# Altium project steve.PrjPcb (part 3 of 3)

## Sheet ltc1474_400mA.SchDoc
size A4
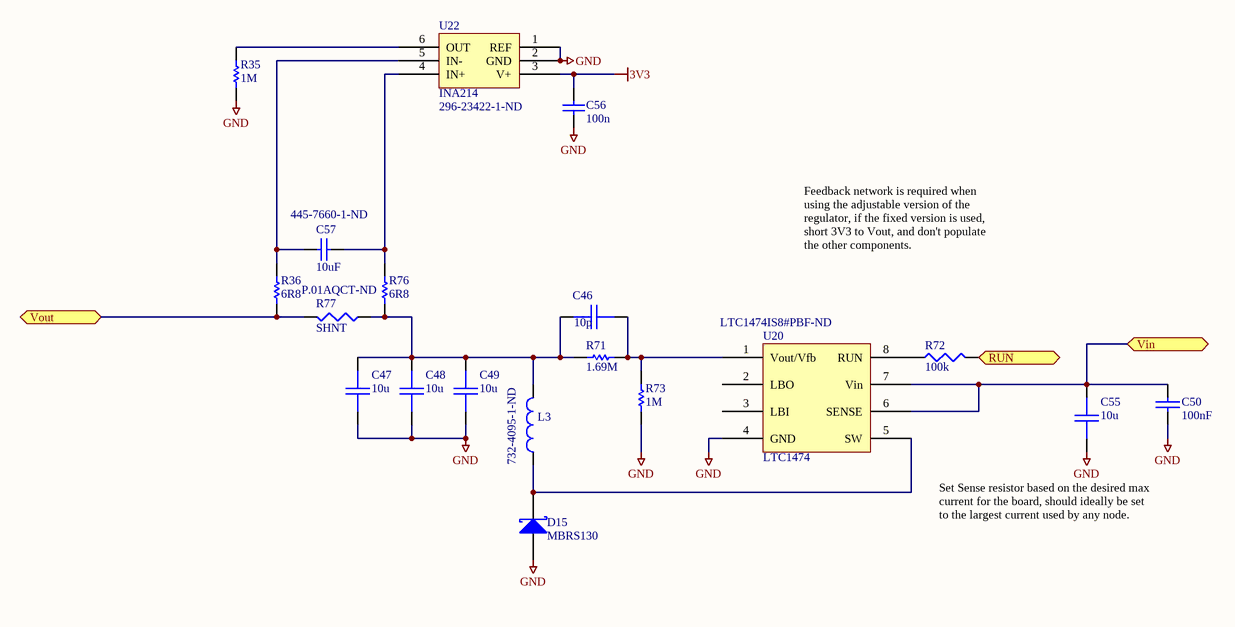
[diagram p11: ltc1474_400mA.SchDoc]

### Parts
C46  10p  [0603]
C47  10u  [1206]
C48  10u  [1206]
C49  10u  [1206]
C50  100nF  [0603]
C55  10u  [1206]
C56  100n  [0603]
C57  10uF  Supplier Part Number 1: 445-7660-1-ND  [0805]
D15  MBRS130  [SMB]
L3  Supplier Part Number 1: 732-4095-1-ND  [WE-TPC-744065221]  (hidden comment: INDUCTOR)
R35  1M  [0603]
R36  6R8  [0603]
R71  1.69M  [0603]
R72  100k  [0603]
R73  1M  [0603]
R76  6R8  [0603]
R77  SHNT  Supplier Part Number 1: P.01AQCT-ND  [0805]
U20  LTC1474  Supplier Part Number 1: LTC1474IS8#PBF-ND  [SO8]
U22  INA214  Supplier Part Number 1: 296-23422-1-ND  [SC70-6]

### Ports
RUN, Vin, Vout

### Nets
3V3: C56.2 U22.3(V+)
GND: C47.2 C48.2 C49.2 C50.2 C55.2 C56.1 D15.A R35.1 R73.1 U20.4(GND) U22.1(REF) U22.2(GND)
Vin: C50.1 C55.1 U20.6(SENSE) U20.7(Vin) ; port Vin
VLED: R36.2 R77.2 ; port Vout
VLED_EN: R72.2 ; port RUN
NetC46_1: C46.1 C47.1 C48.1 C49.1 L3.2 R71.1 R76.2 R77.1
NetC46_2: C46.2 R71.2 R73.2 U20.1(Vout/Vfb)
NetC57_1: C57.1 R36.1 U22.5(IN-)
NetC57_2: C57.2 R76.1 U22.4(IN+)
NetD15_K: D15.K L3.1 U20.5(SW)
NetR35_2: R35.2 U22.6(OUT)
NetR72_1: R72.1 U20.8(RUN)

Not connected (* = marked no-connect by the designer): U20 2(LBO) 3(LBI)

### Notes on the sheet
- Feedback network is required when using the adjustable version of the regulator, if the fixed version is used, short 3V3 to Vout, and don't populate the other components.
- (near C55) Set Sense resistor based on the desired max current for the board, should ideally be set to the largest current used by any node.

### Library data of the parts
C46 = CAP: Capacitor; Manufacturer: TDK Corporation; Manufacturer Part Number: C1608C0G1H100D080AA; Value: 1nF; Description: CAP CER 10PF 50V NP0 0603; Capacitance: 10pF; Voltage - Rated: 50V; Tolerance: ±0.5pF; Temperature Coefficient: C0G, NP0; Revision: July-2002: Re-released for DXP Platform.; Farnell: 317-202; Price: 0.15; Supplier 1: Digi-Key; Supplier Part Number 1: 445-1269-1-ND; RoHS: RoHS Compliant; Category: Capacitors; Stock 1: 206915; Pricing 1: 1=0.12, 10=0.043, 100=0.0198, 250=0.01624, 500=0.0139, 1000=0.01082 (AUD); Packaging: Cut Tape (CT); Mounting Type: Surface Mount, MLCC; Operating Temperature: -55°C ~ 125°C; Applications: General Purpose; Ratings: -; Package / Case: 0603 (1608 Metric); Size / Dimension: 0.063" L x 0.031" W (1.60mm x 0.80mm); Height - Seated (Max): -; Thickness (Max): 0.037" (0.95mm); Lead Spacing: -; Features: -; Lead Style: -; ComponentLink1URL: http://product.tdk.com/capacitor/mlcc/en/documents/mlcc_commercial_general_en.pdf; ComponentLink1Description: http://product.tdk.com/capacitor/mlcc/en/documents/mlcc_commercial_general_en.pdf
C47-C49 C55 = CAP: Capacitor; Manufacturer: TDK Corporation; Manufacturer Part Number: C3216X5R1A106M160AB; Description: CAP CER 10UF 10V 20% X5R 1206; Capacitance: 10µF; Voltage - Rated: 10V; Tolerance: ±20%; Temperature Coefficient: X5R; Supplier 1: Digi-Key; Supplier Part Number 1: 445-1387-1-ND; RoHS: RoHS Compliant; Category: Capacitors; Stock 1: 132841; Pricing 1: 1=0.32, 10=0.274, 100=0.137, 250=0.10276, 500=0.09076, 1000=0.0805 (AUD); Packaging: Cut Tape (CT); Mounting Type: Surface Mount, MLCC; Operating Temperature: -55°C ~ 85°C; Applications: General Purpose; Ratings: -; Package / Case: 1206 (3216 Metric); Size / Dimension: 0.126" L x 0.063" W (3.20mm x 1.60mm); Height - Seated (Max): -; Thickness (Max): 0.071" (1.80mm); Lead Spacing: -; Features: -; Lead Style: -; ComponentLink1URL: http://product.tdk.com/capacitor/mlcc/en/documents/mlcc_commercial_general_en.pdf; ComponentLink1Description: http://product.tdk.com/capacitor/mlcc/en/documents/mlcc_commercial_general_en.pdf
C50 = CAP: Capacitor; Manufacturer: TDK Corporation; Manufacturer Part Number: C1608X7R1H103K080AA; Needed?: NO - HW LAB; Description: CAP CER 10000PF 50V 10% X7R 0603; Capacitance: 10000pF; Voltage - Rated: 50V; Tolerance: ±10%; Temperature Coefficient: X7R; Value: 100nF; Supplier 1: Digi-Key; Supplier Part Number 1: 445-1311-1-ND; RoHS: RoHS Compliant; Category: Capacitors; Stock 1: 569984; Pricing 1: 1=0.14, 10=0.035, 100=0.0159, 250=0.01296, 500=0.0111, 1000=0.00865 (AUD); Packaging: Cut Tape (CT); Mounting Type: Surface Mount, MLCC; Operating Temperature: -55°C ~ 125°C; Applications: General Purpose; Ratings: -; Package / Case: 0603 (1608 Metric); Size / Dimension: 0.063" L x 0.031" W (1.60mm x 0.80mm); Height - Seated (Max): -; Thickness (Max): 0.037" (0.95mm); Lead Spacing: -; Features: -; Lead Style: -; ComponentLink1URL: http://product.tdk.com/capacitor/mlcc/en/documents/mlcc_commercial_general_en.pdf; ComponentLink1Description: http://product.tdk.com/capacitor/mlcc/en/documents/mlcc_commercial_general_en.pdf
C56 = Cap Semi: Capacitor (Semiconductor SIM Model); Value: 100nF; Published: 8-Jun-2000; LatestRevisionDate: 17-Jul-2002; LatestRevisionNote: Re-released for DXP Platform.; PackageReference: C1206; Publisher: Altium Limited; Element14: 9406140; Element14 Price: 0.13
C57 = Cap Semi: Capacitor (Semiconductor SIM Model); Manufacturer: TDK Corporation; Manufacturer Part Number: C2012X5R1A106K125AB; Description: CAP CER 10UF 10V 10% X5R 0805; Capacitance: 10µF; Voltage - Rated: 10V; Tolerance: ±10%; Temperature Coefficient: X5R; Value: 10uF; Element14: 1458902RL; Element14 Price: 0.69; Supplier 1: Digi-Key; RoHS: RoHS Compliant; Category: Capacitors; Stock 1: 260840; Pricing 1: 1=0.24, 10=0.163, 100=0.0833, 250=0.06744, 500=0.05948, 1000=0.05057 (AUD); Packaging: Cut Tape (CT); Mounting Type: Surface Mount, MLCC; Operating Temperature: -55°C ~ 85°C; Applications: General Purpose; Ratings: -; Package / Case: 0805 (2012 Metric); Size / Dimension: 0.079" L x 0.049" W (2.00mm x 1.25mm); Height - Seated (Max): -; Thickness (Max): 0.057" (1.45mm); Lead Spacing: -; Features: -; Lead Style: -; ComponentLink1URL: http://product.tdk.com/capacitor/mlcc/en/documents/mlcc_commercial_general_en.pdf; ComponentLink1Description: http://product.tdk.com/capacitor/mlcc/en/documents/mlcc_commercial_general_en.pdf
D15 = D SCHOTTKY: Schottky Diode; Manufacturer: Fairchild Semiconductor; Manufacturer Part Number: MBRS130L; Description: DIODE SCHOTTKY 30V 2A DO214AA; Voltage - DC Reverse (Vr) (Max): 30V; Current - Average Rectified (Io): 2A; Voltage - Forward (Vf) (Max) @ If: 445mV @ 2A; Speed: Fast Recovery =< 500ns, > 200mA (Io); Current - Reverse Leakage @ Vr: 1mA @ 30V; Revision: July-2002: Re-released for DXP Platform.; Farnell: 708-150; Price: 1.49; Supplier 1: Digi-Key; Supplier Part Number 1: MBRS130LFSCT-ND; RoHS: RoHS Compliant; Category: Discrete Semiconductor Products; Stock 1: 14124; Pricing 1: 1=0.54, 10=0.428, 25=0.3612, 100=0.2942, 250=0.24364, 500=0.20126, 1000=0.15074 (AUD); Packaging: Cut Tape (CT); Diode Type: Schottky; Reverse Recovery Time (trr): -; Capacitance @ Vr, F: -; Mounting Type: Surface Mount; Package / Case: DO-214AA, SMB; Supplier Device Package: DO-214AA (SMB); ComponentLink1URL: http://www.fairchildsemi.com/ds/MB/MBRS130L.pdf; ComponentLink1Description: http://www.fairchildsemi.com/ds/MB/MBRS130L.pdf
L3 = INDUCTOR: Manufacturer: Wurth Electronics Inc; Manufacturer Part Number: 744065221; Description: INDUCTOR POWER 220UH .50A SMD; Type: Ferrite Core; Inductance: 220µH; Current Rating: 500mA; Current - Saturation: 550mA; Tolerance: ±30%; Material - Core: Ferrite; Shielding: Shielded; DC Resistance (DCR): 1 Ohm Max; Frequency - Test: 100kHz; Supplier 1: Digi-Key; RoHS: RoHS Compliant; Category: Inductors, Coils, Chokes; Stock 1: 1996; Pricing 1: 1=4.4, 10=4.081, 25=3.768, 50=3.2652, 100=2.8885, 250=2.76292, 500=2.63734 (AUD); Packaging: Cut Tape (CT); Q @ Freq: -; Frequency - Self Resonant: -; Operating Temperature: -40°C ~ 125°C; Package / Case: Non Standard; Size / Dimension: 0.394" L x 0.394" W x 0.110" H (10.00mm x 10.00mm x 2.80mm); Mounting Type: Surface Mount; ComponentLink1URL: http://katalog.we-online.de/pbs/datasheet/744065221.pdf; ComponentLink1Description: http://katalog.we-online.de/pbs/datasheet/744065221.pdf
R35 R73 = Res Semi: Semiconductor Resistor; Manufacturer: Panasonic Electronic Components; Manufacturer Part Number: ERJ-3EKF1004V; Value: R0; Description: RES 1M OHM 1/10W 1% 0603 SMD; Power (Watts): 0.1W, 1/10W; Temperature Coefficient: ±100ppm/°C; Tolerance: ±1%; Published: 8-Jun-2000; LatestRevisionDate: 17-Jul-2002; LatestRevisionNote: Re-released for DXP Platform.; PackageReference: AXIAL-0.5; Publisher: Altium Limited; PackageDescription: Axial Device, Thru-Hole; 2 Leads; 0.5 in Pin Spacing; Supplier 1: Digi-Key; Supplier Part Number 1: P1.00MHCT-ND; RoHS: RoHS Compliant; Category: Resistors; Stock 1: 1075295; Pricing 1: 1=0.12, 50=0.0166, 100=0.0126, 250=0.00936, 500=0.00692, 1000=0.00461 (AUD); Packaging: Cut Tape (CT); Resistance (Ohms): 1M; Composition: Thick Film; Features: -; Package / Case: 0603 (1608 Metric); Supplier Device Package: 0603; Size / Dimension: 0.063" L x 0.031" W (1.60mm x 0.80mm); Height: 0.022" (0.55mm); Number of Terminations: 2; ComponentLink1URL: http://industrial.panasonic.com/www-cgi/jvcr13pz.cgi?E+PZ+3+AOA0002+ERJ3EKF1004V+7+WW; ComponentLink1Description: http://industrial.panasonic.com/www-cgi/jvcr13pz.cgi?E+PZ+3+AOA0002+ERJ3EKF1004V+7+WW
R36 R76 = Res Semi: Semiconductor Resistor; Manufacturer: Panasonic Electronic Components; Manufacturer Part Number: ERJ-3GEYJ6R8V; Description: RES 6.8 OHM 1/10W 5% 0603 SMD; Resistance (Ohms): 6.8; Power (Watts): 0.1W, 1/10W; Temperature Coefficient: -100/ +600ppm/°C; Tolerance: ±5%; Published: 8-Jun-2000; LatestRevisionDate: 17-Jul-2002; LatestRevisionNote: Re-released for DXP Platform.; PackageReference: AXIAL-0.5; Publisher: Altium Limited; Value: 6R8; Element14: 9331492RL; Element14 Price: 0.08 (min order 50); Supplier 1: Digi-Key; Supplier Part Number 1: P6.8GCT-ND; RoHS: RoHS Compliant; Category: Resistors; Stock 1: 133530; Pricing 1: 1=0.12, 50=0.011, 100=0.0084, 250=0.00624, 500=0.00462, 1000=0.00308 (AUD); Packaging: Cut Tape (CT); Composition: Thick Film; Features: -; Package / Case: 0603 (1608 Metric); Supplier Device Package: 0603; Size / Dimension: 0.063" L x 0.031" W (1.60mm x 0.80mm); Height: 0.022" (0.55mm); Number of Terminations: 2; ComponentLink1URL: http://industrial.panasonic.com/www-cgi/jvcr13pz.cgi?E+PZ+3+AOA0001+ERJ3GEYJ6R8V+7+WW; ComponentLink1Description: http://industrial.panasonic.com/www-cgi/jvcr13pz.cgi?E+PZ+3+AOA0001+ERJ3GEYJ6R8V+7+WW
R71 = Res Semi: Semiconductor Resistor; Manufacturer: Samsung Electro-Mechanics America, Inc; Manufacturer Part Number: RC1608F1694CS; Value: R0; Description: RES 1.69M OHM 1/10W 1% 0603; Power (Watts): 0.1W, 1/10W; Temperature Coefficient: ±300ppm/°C; Tolerance: ±1%; Published: 8-Jun-2000; LatestRevisionDate: 17-Jul-2002; LatestRevisionNote: Re-released for DXP Platform.; PackageReference: AXIAL-0.5; Publisher: Altium Limited; PackageDescription: Axial Device, Thru-Hole; 2 Leads; 0.5 in Pin Spacing; Supplier 1: Digi-Key; Supplier Part Number 1: 1276-4940-1-ND; RoHS: RoHS Compliant; Category: Resistors; Stock 1: 9990; Pricing 1: 1=0.12, 10=0.023, 25=0.0168, 50=0.0128, 100=0.0094, 250=0.00716, 500=0.00572, 1000=0.00421, 2500=0.00365 (AUD); Packaging: Cut Tape (CT); Resistance (Ohms): 1.69M; Composition: Thick Film; Features: -; Package / Case: 0603 (1608 Metric); Supplier Device Package: 0603 (1608 Metric); Size / Dimension: 0.063" L x 0.031" W (1.60mm x 0.80mm); Height: 0.022" (0.55mm); Number of Terminations: 2; ComponentLink1URL: http://www.samsungsem.com/servlet/FileDownload?filename=productcatalog/pdf/Chip_Resistor.pdf; ComponentLink1Description: http://www.samsungsem.com/servlet/FileDownload?filename=productcatalog/pdf/Chip_Resistor.pdf
R72 = RES1: Resistor; Manufacturer: Panasonic Electronic Components; Manufacturer Part Number: ERJ-3EKF1003V; Description: RES 100K OHM 1/10W 1% 0603 SMD; Power (Watts): 0.1W, 1/10W; Temperature Coefficient: ±100ppm/°C; Tolerance: ±1%; Supplier 1: Digi-Key; Supplier Part Number 1: P100KHCT-ND; RoHS: RoHS Compliant; Category: Resistors; Stock 1: 8186012; Pricing 1: 1=0.12, 50=0.0166, 100=0.0126, 250=0.00936, 500=0.00692, 1000=0.00461 (AUD); Packaging: Cut Tape (CT); Resistance (Ohms): 100k; Composition: Thick Film; Features: -; Package / Case: 0603 (1608 Metric); Supplier Device Package: 0603; Size / Dimension: 0.063" L x 0.031" W (1.60mm x 0.80mm); Height: 0.022" (0.55mm); Number of Terminations: 2; ComponentLink1URL: http://industrial.panasonic.com/www-cgi/jvcr13pz.cgi?E+PZ+3+AOA0002+ERJ3EKF1003V+7+WW; ComponentLink1Description: http://industrial.panasonic.com/www-cgi/jvcr13pz.cgi?E+PZ+3+AOA0002+ERJ3EKF1003V+7+WW
R77 = Res3: Resistor; Manufacturer: Panasonic Electronic Components; Manufacturer Part Number: ERJ-6BWFR010V; Description: RES 0.01 OHM 1/2W 1% 0805 SMD; Resistance (Ohms): 0.01; Power (Watts): 0.5W, 1/2W; Temperature Coefficient: ±300ppm/°C; Tolerance: ±1%; Publisher: Altium Limited; Element14: 8067520; Element14 Price: 0.62; Supplier 1: Digi-Key; RoHS: RoHS Compliant; Category: Resistors; Stock 1: 6983; Pricing 1: 1=1.38, 50=0.7394, 100=0.6469, 250=0.573, 500=0.48058, 1000=0.36967 (AUD); Packaging: Cut Tape (CT); Composition: Thick Film; Features: -; Package / Case: 0805 (2012 Metric); Supplier Device Package: 0805; Size / Dimension: 0.079" L x 0.049" W (2.00mm x 1.25mm); Height: 0.030" (0.75mm); Number of Terminations: 2; ComponentLink1URL: http://industrial.panasonic.com/www-data/pdf/AOA0000/AOA0000CE3.pdf; ComponentLink1Description: http://industrial.panasonic.com/www-data/pdf/AOA0000/AOA0000CE3.pdf
U20 = LTC1474: Step-down converter; Manufacturer: Linear Technology; Manufacturer Part Number: LTC1474IS8#PBF; Description: IC REG BUCK ADJ 0.75A 8SOIC; Output Type: Adjustable; Number of Outputs: 1; Voltage - Input: 3 V ~ 18 V; PWM Type: Burst Mode®; Current - Output: 750mA; Synchronous Rectifier: No; Farnell: NA; Supplier 1: Digi-Key; RoHS: RoHS Compliant; Category: Integrated Circuits (ICs); Stock 1: 587; Pricing 1: 1=9.96, 25=6.616, 100=5.2879 (AUD); Packaging: Tube; Type: Step-Down (Buck); Voltage - Output: Adjustable; Frequency - Switching: -; Operating Temperature: -40°C ~ 85°C; Mounting Type: Surface Mount; Package / Case: 8-SOIC (0.154", 3.90mm Width); Supplier Device Package: 8-SOIC; ComponentLink1URL: http://www.linear.com/docs/1377; ComponentLink1Description: http://www.linear.com/docs/1377
U22 = INA214: Current Shunt Monitor; Manufacturer: Texas Instruments; Manufacturer Part Number: INA214AIDCKT; Description: IC CURRENT MONITOR 1% SC70-6; Function: Current Monitor; Sensing Method: High/Low-Side; Accuracy: ±1%; Voltage - Input: 2.7 V ~ 26 V; Element14: 1754262; Element14 Price: $4.22; Supplier 1: Digi-Key; RoHS: RoHS Compliant; Category: Integrated Circuits (ICs); Stock 1: 2023; Pricing 1: 1=2.58, 10=2.336, 25=2.0932, 100=1.0952 (AUD); Packaging: Cut Tape (CT); Current - Output: -; Operating Temperature: -40°C ~ 125°C; Mounting Type: Surface Mount; Package / Case: 6-TSSOP, SC-88, SOT-363; Supplier Device Package: SC-70-6; ComponentLink1URL: http://www.ti.com/lit/ds/symlink/ina210.pdf; ComponentLink1Description: http://www.ti.com/lit/ds/symlink/ina210.pdf

## Sheet status_leds.SchDoc
size A4
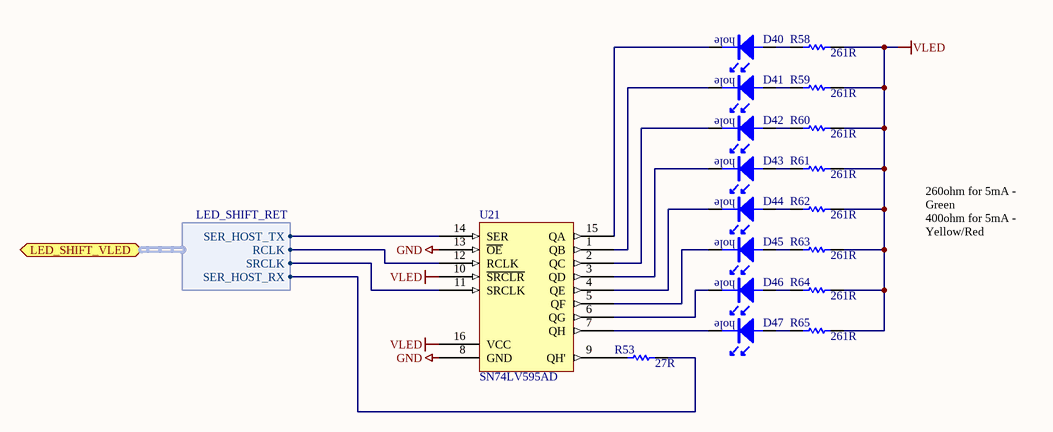
[diagram p12: status_leds.SchDoc]

### Parts
D40  (no value)  [LED0.1]
D41  (no value)  [LED0.1]
D42  (no value)  [LED0.1]
D43  (no value)  [LED0.1]
D44  (no value)  [LED0.1]
D45  (no value)  [LED0.1]
D46  (no value)  [LED0.1]
D47  (no value)  [LED0.1]
R53  27R  [0603]
R58  261R  [0603]
R59  261R  [0603]
R60  261R  [0603]
R61  261R  [0603]
R62  261R  [0603]
R63  261R  [0603]
R64  261R  [0603]
R65  261R  [0603]
U21  SN74LV595AD  [SOIC127P600X175-16N]

### Ports
LED_SHIFT_VLED (harness LED_SHIFT_RET)

### Harnesses
LED_SHIFT_RET: RCLK, SER_HOST_RX, SER_HOST_TX, SRCLK

### Nets
GND: U21.8(GND) U21.13(~{OE})
VLED: R58.1 R59.1 R60.1 R61.1 R62.1 R63.1 R64.1 R65.1 U21.10(~{SRCLR}) U21.16(VCC)
NetD40_A: D40.A R58.2
NetD40_K: D40.K U21.15(QA)
NetD41_A: D41.A R59.2
NetD41_K: D41.K U21.1(QB)
NetD42_A: D42.A R60.2
NetD42_K: D42.K U21.2(QC)
NetD43_A: D43.A R61.2
NetD43_K: D43.K U21.3(QD)
NetD44_A: D44.A R62.2
NetD44_K: D44.K U21.4(QE)
NetD45_A: D45.A R63.2
NetD45_K: D45.K U21.5(QF)
NetD46_A: D46.A R64.2
NetD46_K: D46.K U21.6(QG)
NetD47_A: D47.A R65.2
NetD47_K: D47.K U21.7(QH)
NetR11_1: U21.12(RCLK) ; port LED_SHIFT_VLED.RCLK
NetR12_1: U21.11(SRCLK) ; port LED_SHIFT_VLED.SRCLK
NetR52_1: U21.14(SER) ; port LED_SHIFT_VLED.SER_HOST_TX
NetR53_1: R53.1 ; port LED_SHIFT_VLED.SER_HOST_RX
NetR53_2: R53.2 U21.9(QH')

### Notes on the sheet
- 260ohm for 5mA - Green
  400ohm for 5mA - Yellow/Red
- (in symbol LED_HOLE) hole

### Library data of the parts
D40-D47 = LED_HOLE: through hole LED; Manufacturer: TT Electronics/Optek Technology; Manufacturer Part Number: OVLBG4C7; Description: LED 525NM ROUND GREEN 3MM; Color: Green; Millicandela Rating: 2000mcd; Voltage - Forward (Vf) Typ: 3.4V; Current - Test: 20mA; Wavelength - Dominant: 525nm; Wavelength - Peak: 521nm; Viewing Angle: 45°; Lens Type: Clear; Lens Style/Size: Round with Domed Top, 3mm, T-1; Supplier 1: Digi-Key; Supplier Part Number 1: 365-1174-ND; RoHS: RoHS Compliant; Category: Optoelectronics; Stock 1: 22554; Pricing 1: 1=0.61, 100=0.5516, 250=0.53544, 500=0.51918, 1000=0.48673, 2500=0.4705, 5000=0.45428, 25000=0.43805 (AUD); Packaging: Bulk; Package / Case: Radial; Size / Dimension: -; Height: 5.10mm; Mounting Type: Through Hole; Luminous Flux @ Current - Test: -; ComponentLink1URL: http://media.digikey.com/pdf/Data%20Sheets/Optek%20PDFs/OVLBG4C7.pdf; ComponentLink1Description: http://media.digikey.com/pdf/Data%20Sheets/Optek%20PDFs/OVLBG4C7.pdf
R53 = Res Semi: Semiconductor Resistor; Manufacturer: Panasonic Electronic Components; Manufacturer Part Number: ERJ-3EKF27R0V; Value: 1K; Description: RES 27 OHM 1/10W 1% 0603 SMD; Resistance (Ohms): 27; Power (Watts): 0.1W, 1/10W; Temperature Coefficient: ±100ppm/°C; Tolerance: ±1%; Published: 8-Jun-2000; LatestRevisionDate: 17-Jul-2002; LatestRevisionNote: Re-released for DXP Platform.; PackageReference: AXIAL-0.5; Publisher: Altium Limited; PackageDescription: Axial Device, Thru-Hole; 2 Leads; 0.5 in Pin Spacing; Supplier 1: Digi-Key; Supplier Part Number 1: P27.0HCT-ND; RoHS: RoHS Compliant; Category: Resistors; Stock 1: 89523; Pricing 1: 1=0.12, 50=0.0166, 100=0.0126, 250=0.00936, 500=0.00692, 1000=0.00461 (AUD); Packaging: Cut Tape (CT); Composition: Thick Film; Features: -; Package / Case: 0603 (1608 Metric); Supplier Device Package: 0603; Size / Dimension: 0.063" L x 0.031" W (1.60mm x 0.80mm); Height: 0.022" (0.55mm); Number of Terminations: 2; ComponentLink1URL: http://industrial.panasonic.com/www-cgi/jvcr13pz.cgi?E+PZ+3+AOA0002+ERJ3EKF27R0V+7+WW; ComponentLink1Description: http://industrial.panasonic.com/www-cgi/jvcr13pz.cgi?E+PZ+3+AOA0002+ERJ3EKF27R0V+7+WW
R58-R65 = Res Semi: Semiconductor Resistor; Manufacturer: Panasonic Electronic Components; Manufacturer Part Number: ERJ-3EKF2610V; Value: 1K; Description: RES 261 OHM 1/10W 1% 0603 SMD; Resistance (Ohms): 261; Power (Watts): 0.1W, 1/10W; Temperature Coefficient: ±100ppm/°C; Tolerance: ±1%; Published: 8-Jun-2000; LatestRevisionDate: 17-Jul-2002; LatestRevisionNote: Re-released for DXP Platform.; PackageReference: AXIAL-0.5; Publisher: Altium Limited; PackageDescription: Axial Device, Thru-Hole; 2 Leads; 0.5 in Pin Spacing; Supplier 1: Digi-Key; Supplier Part Number 1: P261HCT-ND; RoHS: RoHS Compliant; Category: Resistors; Stock 1: 84589; Pricing 1: 1=0.12, 50=0.0166, 100=0.0126, 250=0.00936, 500=0.00692, 1000=0.00461 (AUD); Packaging: Cut Tape (CT); Composition: Thick Film; Features: -; Package / Case: 0603 (1608 Metric); Supplier Device Package: 0603; Size / Dimension: 0.063" L x 0.031" W (1.60mm x 0.80mm); Height: 0.022" (0.55mm); Number of Terminations: 2; ComponentLink1URL: http://industrial.panasonic.com/www-cgi/jvcr13pz.cgi?E+PZ+3+AOA0002+ERJ3EKF2610V+7+WW; ComponentLink1Description: http://industrial.panasonic.com/www-cgi/jvcr13pz.cgi?E+PZ+3+AOA0002+ERJ3EKF2610V+7+WW
U21 = SN74LV595AD: 8-Bit Shift Registers with 3-State Output Registers; Manufacturer: Texas Instruments; Manufacturer Part Number: SN74LV595ADR; Description: IC 8-BIT SHFT REG TRI-ST 16-SOIC; Output Type: Tri-State; Number of Elements: 1; Number of Bits per Element: 8; Function: Serial to Parallel, Serial; Voltage - Supply: 2 V ~ 5.5 V; Supplier 1: Digi-Key; Supplier Part Number 1: 296-18747-1-ND; RoHS: RoHS Compliant; Category: Integrated Circuits (ICs); Stock 1: 11778; Pricing 1: 1=1.19, 10=1.041, 25=0.92, 100=0.8018, 250=0.698, 500=0.59416, 1000=0.47591 (AUD); Packaging: Cut Tape (CT); Logic Type: Shift Register; Operating Temperature: -40°C ~ 85°C; Mounting Type: Surface Mount; Package / Case: 16-SOIC (0.154", 3.90mm Width); Supplier Device Package: 16-SOIC N; ComponentLink1URL: http://www.ti.com/lit/ds/symlink/sn74lv595a.pdf; ComponentLink1Description: http://www.ti.com/lit/ds/symlink/sn74lv595a.pdf

## Nets that join several sheets
3V3: can_unisolated_lemo (13 pins), USBserial1 (P1_USBserial1.2), USBserial2 (P1_USBserial2.2), lpc_telem (R38.2 R68.2 R69.2), U_lpc_telem/U_lpc11c14 (14 pins), lpc_ws (R42.2 R43.2), U_lpc_ws/U_lpc11c14 (14 pins), button_io (18 pins), U_button_io/U_IBUT0 (R33_U_IBUT0.2 R34_U_IBUT0.2), U_button_io/U_IBUT1 (R33_U_IBUT1.2 R34_U_IBUT1.2), U_button_io/U_IBUT2 (R33_U_IBUT2.2 R34_U_IBUT2.2), U_button_io/U_IBUT3 (R33_U_IBUT3.2 R34_U_IBUT3.2), U_button_io/U_IBUT4 (R33_U_IBUT4.2 R34_U_IBUT4.2), U_button_io/U_IBUT5 (R33_U_IBUT5.2 R34_U_IBUT5.2), U_button_io/U_IBUT6 (R33_U_IBUT6.2 R34_U_IBUT6.2), U_button_io/U_IBUT7 (R33_U_IBUT7.2 R34_U_IBUT7.2), U_button_io/U_IBUT8 (R33_U_IBUT8.2 R34_U_IBUT8.2), U_button_io/U_IBUT9 (R33_U_IBUT9.2 R34_U_IBUT9.2), U_button_io/U_IBUT10 (R33_U_IBUT10.2 R34_U_IBUT10.2), U_button_io/U_IBUT11 (R33_U_IBUT11.2 R34_U_IBUT11.2), paddles (10 pins), ltc1474_100mA (5 pins), ltc1474_400mA (C56.2 U22.3)
GND: TopLevel (R8.1), can_unisolated_lemo (20 pins), USBserial1 (10 pins), USBserial2 (10 pins), lpc_telem (R67.1), U_lpc_telem/U_lpc11c14 (14 pins), U_lpc_ws/U_lpc11c14 (14 pins), button_io (41 pins), U_button_io/U_IBUT0 (D7_U_IBUT0.2 D7_U_IBUT0.3 SW1_U_IBUT0.2), U_button_io/U_IBUT1 (D7_U_IBUT1.2 D7_U_IBUT1.3 SW1_U_IBUT1.2), U_button_io/U_IBUT2 (D7_U_IBUT2.2 D7_U_IBUT2.3 SW1_U_IBUT2.2), U_button_io/U_IBUT3 (D7_U_IBUT3.2 D7_U_IBUT3.3 SW1_U_IBUT3.2), U_button_io/U_IBUT4 (D7_U_IBUT4.2 D7_U_IBUT4.3 SW1_U_IBUT4.2), U_button_io/U_IBUT5 (D7_U_IBUT5.2 D7_U_IBUT5.3 SW1_U_IBUT5.2), U_button_io/U_IBUT6 (D7_U_IBUT6.2 D7_U_IBUT6.3 SW1_U_IBUT6.2), U_button_io/U_IBUT7 (D7_U_IBUT7.2 D7_U_IBUT7.3 SW1_U_IBUT7.2), U_button_io/U_IBUT8 (D7_U_IBUT8.2 D7_U_IBUT8.3 SW1_U_IBUT8.2), U_button_io/U_IBUT9 (D7_U_IBUT9.2 D7_U_IBUT9.3 SW1_U_IBUT9.2), U_button_io/U_IBUT10 (D7_U_IBUT10.2 D7_U_IBUT10.3 SW1_U_IBUT10.2), U_button_io/U_IBUT11 (D7_U_IBUT11.2 D7_U_IBUT11.3 SW1_U_IBUT11.2), alphanumeric (14 pins), paddles (10 pins), ltc1474_100mA (7 pins), ltc1474_400mA (12 pins), status_leds (U21.8 U21.13)
USB3V3: USBserial1 (5 pins), USBserial2 (5 pins)
USB5V: USBserial1 (5 pins), USBserial2 (5 pins)
Vin: can_unisolated_lemo (6 pins), USBserial1 (D1_USBserial1.K), USBserial2 (D1_USBserial2.K), lpc_telem (R66.2), ltc1474_100mA (6 pins), ltc1474_400mA (C50.1 C55.1 U20.6 U20.7)
VLED: button_io (22 pins), alphanumeric (5 pins), ltc1474_400mA (R36.2 R77.2), status_leds (10 pins)
CAN_RX: can_unisolated_lemo (R55.1), U_lpc_telem/U_lpc11c14 (U1_U_lpc_telem_U_lpc11c14.19)
CAN_RX: can_unisolated_lemo (R57.1), U_lpc_ws/U_lpc11c14 (U1_U_lpc_ws_U_lpc11c14.19)
CAN_TX: can_unisolated_lemo (R56.1), U_lpc_ws/U_lpc11c14 (U1_U_lpc_ws_U_lpc11c14.20)
CAN_TX: can_unisolated_lemo (R54.1), U_lpc_telem/U_lpc11c14 (U1_U_lpc_telem_U_lpc11c14.20)
NetR2_U_lpc_telem_U_lpc11c14_1: USBserial1 (U4_USBserial1.2), U_lpc_telem/U_lpc11c14 (R2_U_lpc_telem_U_lpc11c14.1)
NetR2_U_lpc_ws_U_lpc11c14_1: USBserial2 (U4_USBserial2.2), U_lpc_ws/U_lpc11c14 (R2_U_lpc_ws_U_lpc11c14.1)
NetR4_U_lpc_telem_U_lpc11c14_1: USBserial1 (U4_USBserial1.3), U_lpc_telem/U_lpc11c14 (R4_U_lpc_telem_U_lpc11c14.1)
NetR4_U_lpc_ws_U_lpc11c14_1: USBserial2 (U4_USBserial2.3), U_lpc_ws/U_lpc11c14 (R4_U_lpc_ws_U_lpc11c14.1)
NetR11_1: button_io (7 pins), status_leds (U21.12)
NetR12_1: button_io (7 pins), status_leds (U21.11)
NetR52_1: button_io (R52.1), status_leds (U21.14)
NetR53_1: button_io (U10.14), status_leds (R53.1)
PIO 0.2/SSEL0: U_lpc_ws/U_lpc11c14 (U1_U_lpc_ws_U_lpc11c14.10), button_io (U8.2)
PIO 0.4/SCL: U_lpc_ws/U_lpc11c14 (R6_U_lpc_ws_U_lpc11c14.1 U1_U_lpc_ws_U_lpc11c14.15 U2_U_lpc_ws_U_lpc11c14.1), alphanumeric (U18.5)
PIO 0.5/SDA: U_lpc_ws/U_lpc11c14 (R7_U_lpc_ws_U_lpc11c14.1 U1_U_lpc_ws_U_lpc11c14.16 U2_U_lpc_ws_U_lpc11c14.3), alphanumeric (U18.4)
PIO 0.6: U_lpc_ws/U_lpc11c14 (U1_U_lpc_ws_U_lpc11c14.22), button_io (U14.2)
PIO 0.7: U_lpc_ws/U_lpc11c14 (U1_U_lpc_ws_U_lpc11c14.23), button_io (U14.10)
PIO 0.8/MISO0: U_lpc_ws/U_lpc11c14 (U1_U_lpc_ws_U_lpc11c14.27), button_io (U14.9)
PIO 0.9/MOSI0: U_lpc_ws/U_lpc11c14 (J1_U_lpc_ws_U_lpc11c14.4 U1_U_lpc_ws_U_lpc11c14.28), button_io (U6.3)
PIO 0.10/SCK0: U_lpc_ws/U_lpc11c14 (J1_U_lpc_ws_U_lpc11c14.3 U1_U_lpc_ws_U_lpc11c14.29), button_io (U8.3)
PIO 0.11/ADC0: U_lpc_ws/U_lpc11c14 (U1_U_lpc_ws_U_lpc11c14.32), paddles (D6.3 J4.3)
PIO 1.0/ADC1: U_lpc_ws/U_lpc11c14 (U1_U_lpc_ws_U_lpc11c14.33), paddles (D17.3 J4.1)
PIO 1.1/ADC2: U_lpc_ws/U_lpc11c14 (U1_U_lpc_ws_U_lpc11c14.34), paddles (D16.3 J5.3)
PIO 1.2/ADC3: U_lpc_ws/U_lpc11c14 (U1_U_lpc_ws_U_lpc11c14.35), paddles (D19.3 J5.1)
PIO 1.3/ADC4: lpc_telem (R66.1 R67.2), U_lpc_telem/U_lpc11c14 (J1_U_lpc_telem_U_lpc11c14.2 U1_U_lpc_telem_U_lpc11c14.39)
PIO 1.4/ADC5/WAKEUP: can_unisolated_lemo (D18.3 R25.1), U_lpc_ws/U_lpc11c14 (U1_U_lpc_ws_U_lpc11c14.40)
PIO 1.5: U_lpc_ws/U_lpc11c14 (U1_U_lpc_ws_U_lpc11c14.45), button_io (U9.2)
PIO 1.6/RX: USBserial1 (U4_USBserial1.1), U_lpc_telem/U_lpc11c14 (U1_U_lpc_telem_U_lpc11c14.46)
PIO 1.6/RX: USBserial2 (U4_USBserial2.1), U_lpc_ws/U_lpc11c14 (U1_U_lpc_ws_U_lpc11c14.46)
PIO 1.7/TX: USBserial1 (U4_USBserial1.5), U_lpc_telem/U_lpc11c14 (U1_U_lpc_telem_U_lpc11c14.47)
PIO 1.7/TX: USBserial2 (U4_USBserial2.5), U_lpc_ws/U_lpc11c14 (U1_U_lpc_ws_U_lpc11c14.47)
PIO 1.8: U_lpc_ws/U_lpc11c14 (U1_U_lpc_ws_U_lpc11c14.9), button_io (U9.9)
PIO 1.9: U_lpc_ws/U_lpc11c14 (U1_U_lpc_ws_U_lpc11c14.17), button_io (U9.10)
PIO 1.10/ADC6: can_unisolated_lemo (U15.6), U_lpc_telem/U_lpc11c14 (U1_U_lpc_telem_U_lpc11c14.30)
PIO 1.11/ADC7: U_lpc_ws/U_lpc11c14 (U1_U_lpc_ws_U_lpc11c14.42), button_io (U11.2)
PIO 2.0/SSEL1: lpc_telem (R38.1 R39.1), U_lpc_ws/U_lpc11c14 (U1_U_lpc_ws_U_lpc11c14.2)
PIO 2.0/SSEL1: lpc_telem (R39.2), U_lpc_telem/U_lpc11c14 (U1_U_lpc_telem_U_lpc11c14.2)
PIO 2.1/SCK1: lpc_telem (R40.1), U_lpc_ws/U_lpc11c14 (U1_U_lpc_ws_U_lpc11c14.13)
PIO 2.1/SCK1: lpc_telem (R40.2), U_lpc_telem/U_lpc11c14 (U1_U_lpc_telem_U_lpc11c14.13)
PIO 2.2/MISO1: U_lpc_telem/U_lpc11c14 (U1_U_lpc_telem_U_lpc11c14.26), lpc_ws (R44.1)
PIO 2.2/MISO1: lpc_ws (R44.2), U_lpc_ws/U_lpc11c14 (U1_U_lpc_ws_U_lpc11c14.26)
PIO 2.3/MOSI1: lpc_telem (R41.1), U_lpc_ws/U_lpc11c14 (U1_U_lpc_ws_U_lpc11c14.38)
PIO 2.3/MOSI1: lpc_telem (R41.2), U_lpc_telem/U_lpc11c14 (U1_U_lpc_telem_U_lpc11c14.38)
PIO 2.5: U_lpc_ws/U_lpc11c14 (U1_U_lpc_ws_U_lpc11c14.21), button_io (U11.9)
PIO 2.6: U_lpc_ws/U_lpc11c14 (U1_U_lpc_ws_U_lpc11c14.1), button_io (U5.2)
PIO 2.7: U_lpc_ws/U_lpc11c14 (U1_U_lpc_ws_U_lpc11c14.11), button_io (U5.9)
PIO 2.8: U_lpc_ws/U_lpc11c14 (U1_U_lpc_ws_U_lpc11c14.12), button_io (U5.10)
PIO 2.9: can_unisolated_lemo (Q1.D R24.1), U_lpc_ws/U_lpc11c14 (U1_U_lpc_ws_U_lpc11c14.24)
PIO 2.10: U_lpc_ws/U_lpc11c14 (U1_U_lpc_ws_U_lpc11c14.25), button_io (U11.10)
PIO 2.11: lpc_ws (R45.1), U_lpc_ws/U_lpc11c14 (U1_U_lpc_ws_U_lpc11c14.31)
PIO 3.0: lpc_telem (D9.K), U_lpc_telem/U_lpc11c14 (U1_U_lpc_telem_U_lpc11c14.36)
PIO 3.0: lpc_ws (D11.K), U_lpc_ws/U_lpc11c14 (U1_U_lpc_ws_U_lpc11c14.36)
PIO 3.1: lpc_telem (D8.K), U_lpc_telem/U_lpc11c14 (U1_U_lpc_telem_U_lpc11c14.37)
PIO 3.1: lpc_ws (D10.K), U_lpc_ws/U_lpc11c14 (U1_U_lpc_ws_U_lpc11c14.37)
PIO 3.2: U_lpc_telem/U_lpc11c14 (U1_U_lpc_telem_U_lpc11c14.43), U_lpc_ws/U_lpc11c14 (U1_U_lpc_ws_U_lpc11c14.43)
PIO 3.3: U_lpc_telem/U_lpc11c14 (U1_U_lpc_telem_U_lpc11c14.48), U_lpc_ws/U_lpc11c14 (U1_U_lpc_ws_U_lpc11c14.48)
VLED_EN: TopLevel (R8.2), lpc_ws (R45.2), ltc1474_400mA (R72.2)